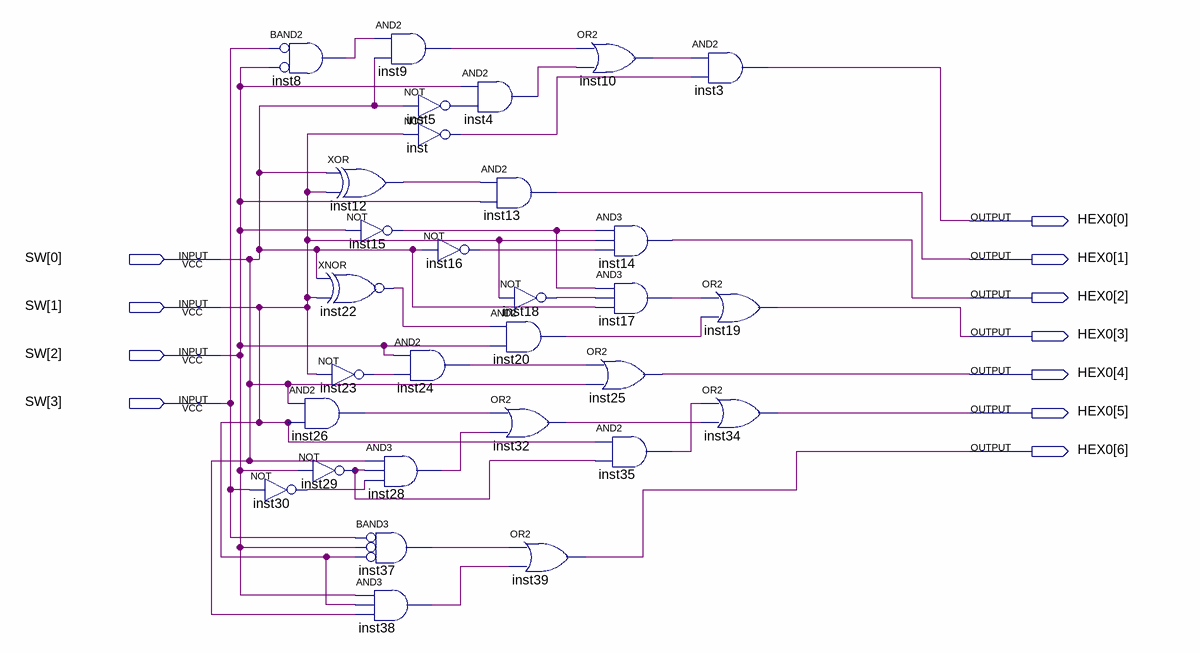
[diagram p0: schematic sheet]
// Quartus schematic qwwq.bdf as structural Verilog: 30 symbols, 11 pins
module qwwq (
  input  [3:0] SW,
  output [6:0] HEX0
);

  wire inst4_out, inst5_out, inst8_out, inst9_out, inst10_out, inst12_out, inst15_out, inst16_out,
       inst17_out, inst18_out, inst20_out, inst22_out, inst23_out, inst24_out, inst26_out, inst28_out,
       inst29_out, inst30_out, inst32_out, inst35_out, inst37_out, inst38_out, inst_out;

  not inst30 (inst30_out, SW[3]);
  and inst8 (inst8_out, ~SW[3], ~SW[2]);  // BAND2
  xor inst12 (inst12_out, SW[0], SW[1]);
  xnor inst22 (inst22_out, SW[0], SW[1]);
  not inst23 (inst23_out, SW[1]);
  and inst26 (inst26_out, SW[0], SW[1]);
  not inst29 (inst29_out, SW[2]);
  and inst9 (inst9_out, inst8_out, SW[0]);
  not inst5 (inst5_out, SW[0]);
  not inst (inst_out, SW[1]);
  not inst15 (inst15_out, SW[2]);
  and inst24 (inst24_out, SW[2], inst23_out);
  and inst28 (inst28_out, SW[0], inst29_out, inst30_out);
  and inst37 (inst37_out, ~SW[3], ~SW[2], ~SW[1]);  // BAND3
  and inst38 (inst38_out, SW[2], SW[1], SW[0]);
  and inst4 (inst4_out, SW[2], inst5_out);
  and inst13 (HEX0[1], inst12_out, SW[2]);
  not inst16 (inst16_out, SW[0]);
  not inst18 (inst18_out, SW[1]);
  and inst20 (inst20_out, inst22_out, SW[2]);
  or inst32 (inst32_out, inst26_out, inst28_out);
  or inst39 (HEX0[6], inst37_out, inst38_out);
  or inst10 (inst10_out, inst9_out, inst4_out);
  and inst14 (HEX0[2], inst15_out, SW[1], inst16_out);
  and inst17 (inst17_out, inst15_out, inst18_out, SW[0]);
  or inst25 (HEX0[4], inst24_out, SW[0]);
  and inst35 (inst35_out, SW[1], inst29_out);
  and inst3 (HEX0[0], inst10_out, inst_out);
  or inst19 (HEX0[3], inst17_out, inst20_out);
  or inst34 (HEX0[5], inst35_out, inst32_out);
endmodule
